# Altium schematic sheet RF_filter.SchDoc
size A4; SheetNumber: 4; SheetTotal: 7
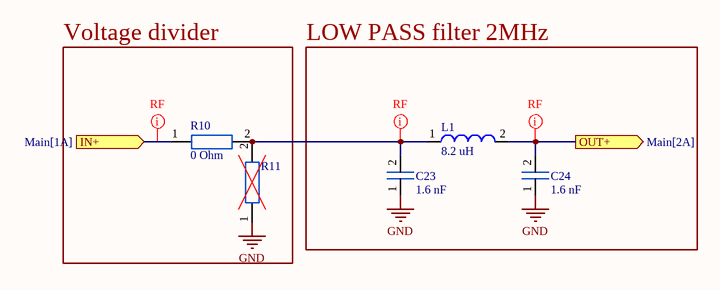
[diagram p0: RF_filter.SchDoc]

## Parts
C23  1.6 nF  [0402_footprint]
C24  1.6 nF  [0402_footprint]
L1  8.2 uH  [0603_FOOTPRINT]
R10  0 Ohm  [0402_footprint]
R11  (no value)  [0402_footprint]

## Blocks framed on the sheet
Voltage divider: R10 R11
LOW PASS filter 2MHz: C23 C24 L1

## Ports
IN+ (in, see Main[1A]), OUT+ (out, see Main[2A])

## Nets
GND: C23.1 C24.1 R11.1
IN+: R10.1 ; port IN+
OUT+: C24.2 L1.2 ; port OUT+
NetC23_2: C23.2 L1.1 R10.2 R11.2

## Layout directives
net class RF: IN+, NetC23_2, OUT+

## Library data of the parts
C23 C24 = Capacitor_0402: 0402 capacitor
L1 = Inductor_0603: 0603 inductor
R10 R11 = Resistor_0402